# Altium project PM06-电源板.PrjPcb
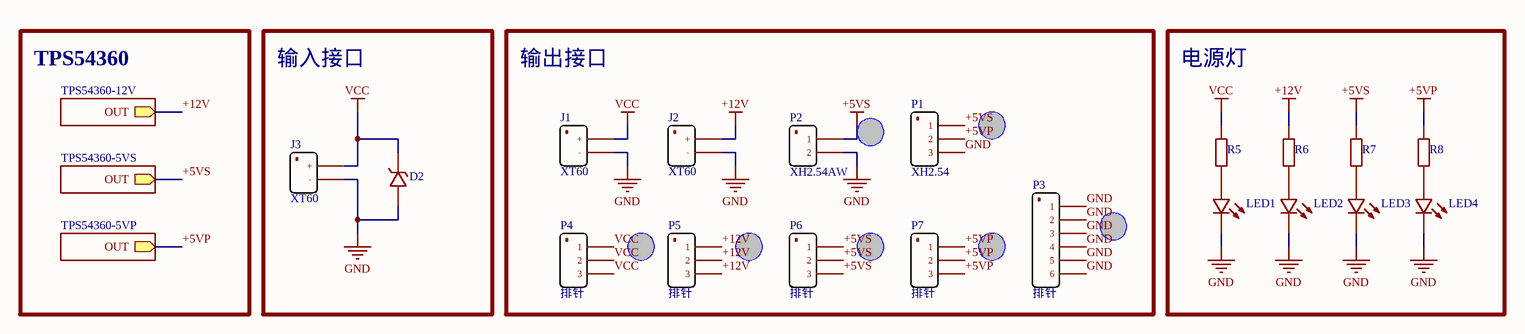
[diagram p0: main.SchDoc]
2 sheets, 58 parts. Net scope: hierarchical (ports join the sheet entries above them; power ports are global).
Board file: PM06-电源板-V1.PcbDoc
Sheets:
  main.SchDoc
    TPS54360-12V = TPS54360.SchDoc
    TPS54360-5VS = TPS54360.SchDoc
    TPS54360-5VP = TPS54360.SchDoc

## Sheet main.SchDoc
size A4; SheetNumber: 1; SheetTotal: 2

### Parts
D2  SMAJ24A  [SMA]  (value not drawn)
J1  XT60  [XT30-PW-F]
J2  XT60  [XT30-PW-F]
J3  XT60  [XT60-PT-M]
LED1  LED  [0603D]  (value not drawn)
LED2  LED  [0603D]  (value not drawn)
LED3  LED  [0603D]  (value not drawn)
LED4  LED  [0603D]  (value not drawn)
P1  XH2.54  [XH2.54_AW_1*3]
P2  XH2.54AW  [XH2.54_AW_1*2]
P3  排针  [Pin-PB-M-1*6]
P4  排针  [Pin-PB-M-1*3]
P5  排针  [Pin-PB-M-1*3]
P6  排针  [Pin-PB-M-1*3]
P7  排针  [Pin-PB-M-1*3]
R5  10K  [0603R]  (value not drawn)
R6  10K  [0603R]  (value not drawn)
R7  10K  [0603R]  (value not drawn)
R8  10K  [0603R]  (value not drawn)

### Blocks framed on the sheet
输入接口: D2 J3
输出接口: J1 J2 P1-P7
电源灯: LED1-LED4 R5-R8

### Sub-sheets
TPS54360-5VP = TPS54360.SchDoc: OUT (out)
TPS54360-5VS = TPS54360.SchDoc: OUT (out)
TPS54360-12V = TPS54360.SchDoc: OUT (out)

### Nets
+5VP: P1.2 P7.1 P7.2 P7.3 R8.2 ; sheet TPS54360-5VP/OUT
+5VS: P1.1 P2.1 P6.1 P6.2 P6.3 R7.2 ; sheet TPS54360-5VS/OUT
+12V: J2.1 P5.1 P5.2 P5.3 R6.2 ; sheet TPS54360-12V/OUT
GND: D2.1 J1.2 J2.2 J3.2 LED1.2 LED2.2 LED3.2 LED4.2 P1.3 P2.2 P3.1 P3.2 P3.3 P3.4 P3.5 P3.6
VCC: D2.2 J1.1 J3.1 P4.1 P4.2 P4.3 R5.2
NetLED1_1: LED1.1 R5.1
NetLED2_1: LED2.1 R6.1
NetLED3_1: LED3.1 R7.1
NetLED4_1: LED4.1 R8.1

### Notes on the sheet
- TPS54360
- (in symbol 接口_XT) +; -

### Library data of the parts
D2 = 二极管_瞬态抑制
J1-J3 = 接口_XT
LED1-LED4 = 二极管_贴片发光
P1 P4-P7 = 接插件1*3
P2 = 接插件1*2
P3 = 接插件1*6
R5-R8 = 电阻_贴片

## Sheet TPS54360.SchDoc
size A4; SheetNumber: 2; SheetTotal: 2
Used 3 times, as channels TPS54360-12V, TPS54360-5VS, TPS54360-5VP. Parts and nets are listed once, with the designators drawn on the sheet.
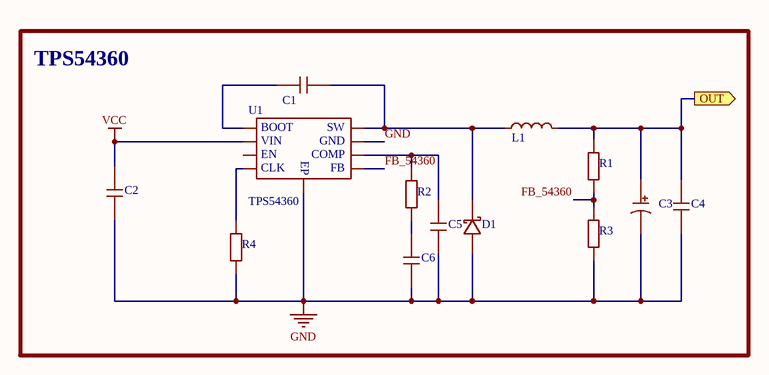
[diagram p1: TPS54360.SchDoc]

### Parts
C1  100nF  [0603C]  (value not drawn)
C2  4.7uF  [0805C]  (value not drawn)
C3  钽电容  [3528B/1210]  (value not drawn)
C4  47uF  [0805C]  (value not drawn)
C5  4.7nF  [0603C]  (value not drawn)
C6  4.7nF  [0603C]  (value not drawn)
D1  SS56  [SMA]  (value not drawn)
L1  10uH  [0630L]  (value not drawn)
R1  60.4K  [0603R]  (value not drawn)
R2  28.7K  [0603R]  (value not drawn)
R3  11.5K  [0603R]  (value not drawn)
R4  124K  [0603R]  (value not drawn)
U1  TPS54360  [SOP-8-PP]

### Blocks framed on the sheet
TPS54360: C1-C6 D1 L1 R1-R4 U1

### Ports
OUT (out)

### Nets
GND: C2.1 C3.2 C4.1 C5.2 C6.2 D1.1 R3.1 R4.1 U1.7 U1.9
VCC: C2.2 U1.2
FB_54360: R1.1 R3.2 U1.5
OUT: C3.1 C4.2 L1.2 R1.2 ; port OUT
NetC1_1: C1.1 D1.2 L1.1 U1.8
NetC1_2: C1.2 U1.1
NetC5_1: C5.1 R2.2 U1.6
NetC6_1: C6.1 R2.1
NetR4_2: R4.2 U1.4

Not connected (* = marked no-connect by the designer): U1 3

### Channels
TPS54360-12V: designators end in _TPS54360-12V; ports OUT=+12V
TPS54360-5VS: designators end in _TPS54360-5VS; ports OUT=+5VS
TPS54360-5VP: designators end in _TPS54360-5VP; ports OUT=+5VP

### Notes on the sheet
- (in symbol 芯片/IC-电源管理-TPS54360) BOOT; SW; VIN; GND; EN; COMP; EP; CLK; FB

### Library data of the parts
C1 C2 C4-C6 = 电容_贴片
C3 = 电容_贴片钽
D1 = 二极管_肖特基
L1 = 电感_贴片
R1-R4 = 电阻_贴片
U1 = 芯片/IC-电源管理-TPS54360

## Nets that join several sheets
+5VP: main (5 pins), TPS54360-5VP (C3_TPS54360-5VP.1 C4_TPS54360-5VP.2 L1_TPS54360-5VP.2 R1_TPS54360-5VP.2)
+5VS: main (6 pins), TPS54360-5VS (C3_TPS54360-5VS.1 C4_TPS54360-5VS.2 L1_TPS54360-5VS.2 R1_TPS54360-5VS.2)
+12V: main (5 pins), TPS54360-12V (C3_TPS54360-12V.1 C4_TPS54360-12V.2 L1_TPS54360-12V.2 R1_TPS54360-12V.2)
GND: main (16 pins), TPS54360-12V (10 pins), TPS54360-5VS (10 pins), TPS54360-5VP (10 pins)
VCC: main (7 pins), TPS54360-12V (C2_TPS54360-12V.2 U1_TPS54360-12V.2), TPS54360-5VS (C2_TPS54360-5VS.2 U1_TPS54360-5VS.2), TPS54360-5VP (C2_TPS54360-5VP.2 U1_TPS54360-5VP.2)